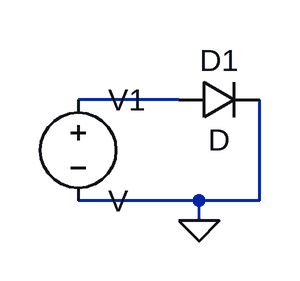
[diagram p0: schematic p4 diode.asc]
p4 diode.asc, the LTspice schematic file:
Version 4
SHEET 1 880 680
WIRE 80 96 0 96
WIRE 96 176 0 176
WIRE 144 176 144 96
WIRE 144 176 96 176
WIRE 96 192 96 176
FLAG 96 192 0
SYMBOL voltage 0 80 R0
SYMATTR InstName V1
SYMBOL diode 80 112 R270
WINDOW 0 32 32 VTop 2
WINDOW 3 0 32 VBottom 2
SYMATTR InstName D1

The netlist it stands for:
* p4 diode.asc
V1 N001 0 V
D1 N001 0 D
.model D D
.lib standard.dio
.backanno
.end